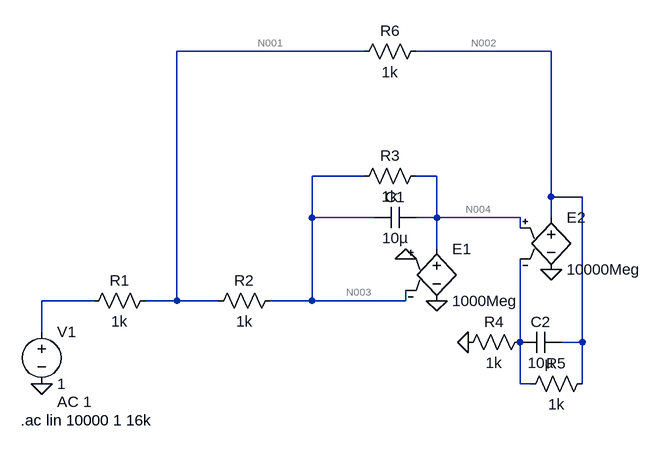
[diagram p0: schematic Draft1.asc]
Draft1.asc, the LTspice schematic file:
Version 4
SHEET 1 880 680
WIRE 144 -192 -144 -192
WIRE 432 -192 224 -192
WIRE 144 0 64 0
WIRE 256 0 224 0
WIRE 432 32 432 -192
WIRE 480 32 432 32
WIRE 64 64 64 0
WIRE 160 64 64 64
WIRE 256 64 256 0
WIRE 256 64 224 64
WIRE 384 64 256 64
WIRE 432 64 432 32
WIRE 384 80 384 64
WIRE 256 112 256 64
WIRE -272 192 -352 192
WIRE -144 192 -144 -192
WIRE -144 192 -192 192
WIRE -80 192 -144 192
WIRE 64 192 64 64
WIRE 64 192 0 192
WIRE 208 192 208 176
WIRE 208 192 64 192
WIRE -352 240 -352 192
WIRE 384 256 384 128
WIRE 480 256 480 32
WIRE 480 256 448 256
WIRE 384 320 384 256
WIRE 400 320 384 320
WIRE 480 320 480 256
FLAG -352 320 0
FLAG 304 256 0
FLAG 256 192 0
FLAG 432 144 0
FLAG 208 128 0
SYMBOL e 256 96 R0
SYMATTR InstName E1
SYMATTR Value 1000Meg
SYMBOL e 432 48 R0
SYMATTR InstName E2
SYMATTR Value 10000Meg
SYMBOL voltage -352 224 R0
WINDOW 123 24 124 Left 2
WINDOW 39 0 0 Left 0
SYMATTR InstName V1
SYMATTR Value 1
SYMATTR Value2 AC 1
SYMBOL res -176 176 R90
WINDOW 0 0 56 VBottom 2
WINDOW 3 32 56 VTop 2
SYMATTR InstName R1
SYMATTR Value 1k
SYMBOL res 16 176 R90
WINDOW 0 0 56 VBottom 2
WINDOW 3 32 56 VTop 2
SYMATTR InstName R2
SYMATTR Value 1k
SYMBOL res 240 -16 R90
WINDOW 0 0 56 VBottom 2
WINDOW 3 32 56 VTop 2
SYMATTR InstName R3
SYMATTR Value 1k
SYMBOL res 400 240 R90
WINDOW 0 0 56 VBottom 2
WINDOW 3 32 56 VTop 2
SYMATTR InstName R4
SYMATTR Value 1k
SYMBOL res 496 304 R90
WINDOW 0 0 56 VBottom 2
WINDOW 3 32 56 VTop 2
SYMATTR InstName R5
SYMATTR Value 1k
SYMBOL res 240 -208 R90
WINDOW 0 0 56 VBottom 2
WINDOW 3 32 56 VTop 2
SYMATTR InstName R6
SYMATTR Value 1k
SYMBOL cap 224 48 R90
WINDOW 0 0 32 VBottom 2
WINDOW 3 32 32 VTop 2
SYMATTR InstName C1
SYMATTR Value 10µ
SYMBOL cap 448 240 R90
WINDOW 0 0 32 VBottom 2
WINDOW 3 32 32 VTop 2
SYMATTR InstName C2
SYMATTR Value 10µ
TEXT -384 376 Left 2 !.ac lin 10000 1 16k

The netlist it stands for:
* Draft1.asc
E1 N004 0 0 N003 1000Meg
E2 N002 0 N004 N006 10000Meg
V1 N005 0 1 AC 1
R1 N001 N005 1k
R2 N003 N001 1k
R3 N004 N003 1k
R4 N006 0 1k
R5 N002 N006 1k
R6 N002 N001 1k
C1 N004 N003 10µ
C2 N002 N006 10µ
.ac lin 10000 1 16k
.backanno
.end

* Results of the author's LTspice run, read from the files saved beside the schematic
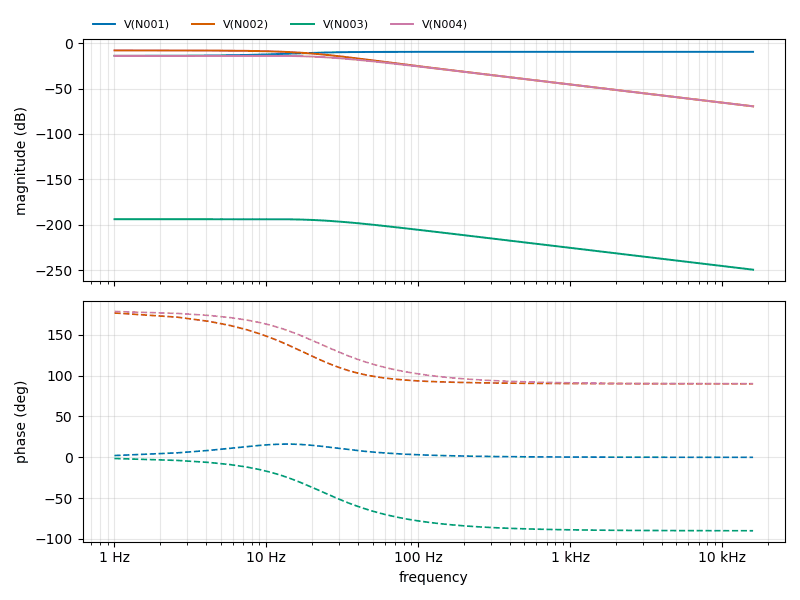
[diagram p1: AC Analysis of Draft1.asc, plotted from the saved traces]
* AC Analysis, 1 run:
*   V(N001): -13.96 dB at 1 Hz, -9.54 dB at 16 kHz, peak -9.54 dB at 16 kHz, 3 dB below the peak at 9.364 Hz
*   V(N002): -7.97 dB at 1 Hz, -69.59 dB at 16 kHz, peak -7.97 dB at 1 Hz, 3 dB below the peak at 18.48 Hz
*   V(N003): -193.98 dB at 1 Hz, -249.59 dB at 16 kHz, peak -193.85 dB at 9 Hz, 3 dB below the peak at 31.58 Hz
*   V(N004): -13.98 dB at 1 Hz, -69.59 dB at 16 kHz, peak -13.85 dB at 9 Hz, 3 dB below the peak at 31.58 Hz